# Altium schematic sheet bqZUM_MCU.SchDoc: MCU
size A4; Date: 20140214; Author: bq; CompanyName: bq - Mundo Reader; Organization: bq - Mundo Reader; DocumentNumber: 2; Revision: 3; SheetNumber: 2; SheetTotal: 8; ProjectName: bqduino
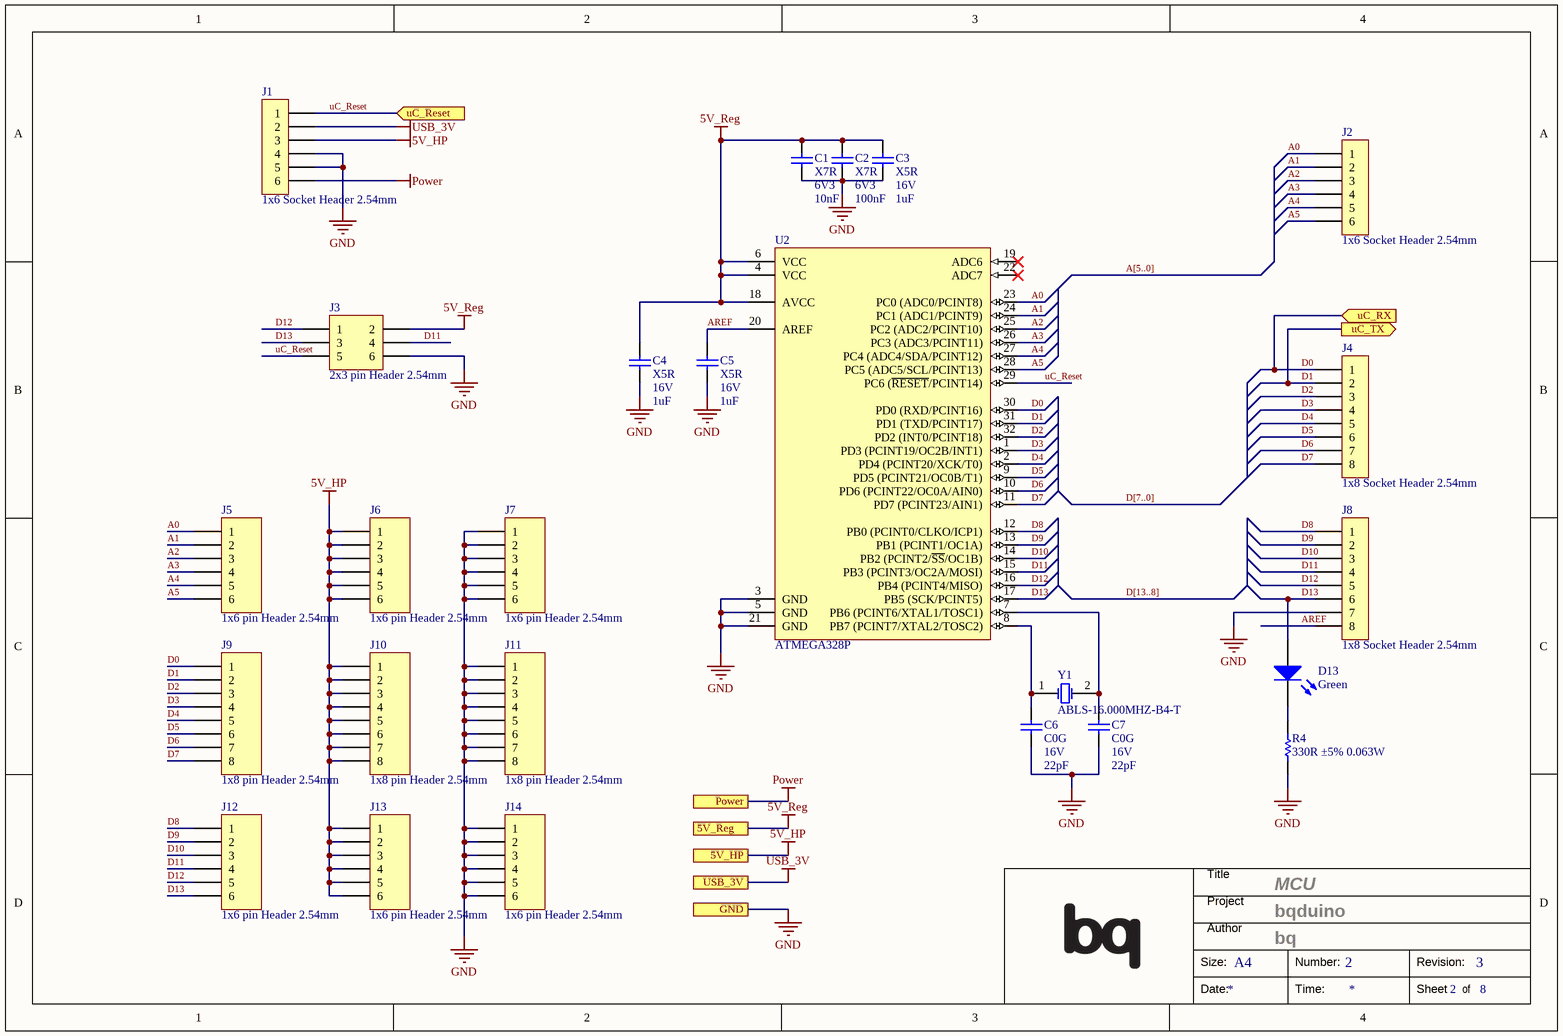
[diagram p0: bqZUM_MCU.SchDoc]

## Parts
C1  Dielectric: X7R  Voltage: 6V3  Capacitance: 10nF  [C0402]  (hidden comment: Capacitor)
C2  Dielectric: X7R  Voltage: 6V3  Capacitance: 100nF  [C0402]  (hidden comment: Capacitor)
C3  Dielectric: X5R  Voltage: 16V  Capacitance: 1uF  [C0603]  (hidden comment: Capacitor)
C4  Dielectric: X5R  Voltage: 16V  Capacitance: 1uF  [C0603]  (hidden comment: Capacitor)
C5  Dielectric: X5R  Voltage: 16V  Capacitance: 1uF  [C0603]  (hidden comment: Capacitor)
C6  Dielectric: C0G  Voltage: 16V  Capacitance: 22pF  [C0402]  (hidden comment: Capacitor)
C7  Dielectric: C0G  Voltage: 16V  Capacitance: 22pF  [C0402]  (hidden comment: Capacitor)
D13  Green  [LED0603]
J1  1x6 Socket Header 2.54mm  [1x6 Socket Header THT 2.54mm]
J2  1x6 Socket Header 2.54mm  [1x6 Socket Header THT 2.54mm]
J3  2x3 pin Header 2.54mm  [2x3 Pin Header 2.54]
J4  1x8 Socket Header 2.54mm  [1x8 Socket Header THT 2.54mm]
J5  1x6 pin Header 2.54mm  [1x6 Pin Header 2.54]
J6  1x6 pin Header 2.54mm  [1x6 Pin Header 2.54]
J7  1x6 pin Header 2.54mm  [1x6 Pin Header 2.54]
J8  1x8 Socket Header 2.54mm  [1x8 Socket Header THT 2.54mm]
J9  1x8 pin Header 2.54mm  [1x8 Pin Header 2.54]
J10  1x8 pin Header 2.54mm  [1x8 Pin Header 2.54]
J11  1x8 pin Header 2.54mm  [1x8 Pin Header 2.54]
J12  1x6 pin Header 2.54mm  [1x6 Pin Header 2.54]
J13  1x6 pin Header 2.54mm  [1x6 Pin Header 2.54]
J14  1x6 pin Header 2.54mm  [1x6 Pin Header 2.54]
R4  value 330R ±5% 0.063W  [R0402]  (hidden comment: Resistor)
U2  ATMEGA328P  [TQFP32]
Y1  ABLS-16.000MHZ-B4-T  [XTAL 11.4x4.7]

## Ports
5V_HP, 5V_Reg, GND, Power, uC_Reset (in), uC_RX (in), uC_TX (out), USB_3V

## Nets
5V_HP: J1.3 J6.1 J6.2 J6.3 J6.4 J6.5 J6.6 J10.1 J10.2 J10.3 J10.4 J10.5 J10.6 J10.7 J10.8 J13.1 J13.2 J13.3 J13.4 J13.5 J13.6 ; port 5V_HP
5V_Reg: C1.2 C2.2 C3.2 C4.2 J3.2 U2.4(VCC) U2.6(VCC) U2.18(AVCC) ; port 5V_Reg
GND: C1.1 C2.1 C3.1 C4.1 C5.1 C6.1 C7.1 J1.4 J1.5 J3.6 J7.1 J7.2 J7.3 J7.4 J7.5 J7.6 J8.7 J11.1 J11.2 J11.3 J11.4 J11.5 J11.6 J11.7 J11.8 J14.1 J14.2 J14.3 J14.4 J14.5 J14.6 R4.1 U2.3(GND) U2.5(GND) U2.21(GND) ; port GND
Power: J1.6 ; port Power
USB_3V: J1.2 ; port USB_3V
A0: J2.1 J5.1 U2.23(PC0_(ADC0/PCINT8))
A1: J2.2 J5.2 U2.24(PC1_(ADC1/PCINT9))
A2: J2.3 J5.3 U2.25(PC2_(ADC2/PCINT10))
A3: J2.4 J5.4 U2.26(PC3_(ADC3/PCINT11))
A4: J2.5 J5.5 U2.27(PC4_(ADC4/SDA/PCINT12))
A5: J2.6 J5.6 U2.28(PC5_(ADC5/SCL/PCINT13))
AREF: C5.2 J8.8 U2.20(AREF)
D0: J4.1 J9.1 U2.30(PD0_(RXD/PCINT16)) ; port uC_RX
D1: J4.2 J9.2 U2.31(PD1_(TXD/PCINT17)) ; port uC_TX
D2: J4.3 J9.3 U2.32(PD2_(INT0/PCINT18))
D3: J4.4 J9.4 U2.1(PD3_(PCINT19/OC2B/INT1))
D4: J4.5 J9.5 U2.2(PD4_(PCINT20/XCK/T0))
D5: J4.6 J9.6 U2.9(PD5_(PCINT21/OC0B/T1))
D6: J4.7 J9.7 U2.10(PD6_(PCINT22/OC0A/AIN0))
D7: J4.8 J9.8 U2.11(PD7_(PCINT23/AIN1))
D8: J8.1 J12.1 U2.12(PB0_(PCINT0/CLKO/ICP1))
D9: J8.2 J12.2 U2.13(PB1_(PCINT1/OC1A))
D10: J8.3 J12.3 U2.14(PB2_(PCINT2/~{SS}/OC1B))
D11: J3.4 J8.4 J12.4 U2.15(PB3_(PCINT3/OC2A/MOSI))
D12: J3.1 J8.5 J12.5 U2.16(PB4_(PCINT4/MISO))
D13: D13.A J3.3 J8.6 J12.6 U2.17(PB5_(SCK/PCINT5))
uC_Reset: J1.1 J3.5 U2.29(PC6_(~{RESET}/PCINT14)) ; port uC_Reset
NetC6_2: C6.2 U2.8(PB7_(PCINT7/XTAL2/TOSC2)) Y1.1(OSC1)
NetC7_2: C7.2 U2.7(PB6_(PCINT6/XTAL1/TOSC1)) Y1.2(OSC2)
NetD13_K: D13.K R4.2

Not connected (* = marked no-connect by the designer): U2 19(ADC6)* 22(ADC7)*

## Buses and harness runs
bus A[5..0]
bus D[7..0]
bus D[13..8]

## Notes on the sheet
- Title
- Project
- Size:
- Author
- A4
- Number:
- Revision:
- Date:
- Time:
- Sheet
- of

## Library data of the parts
C1 = C0402_10nF_6V3_±10%: Manufacturer: Kemet; Value: 10nF ±10% 6V3; Tolerance: ±10%; OrderingCode: C0402C103K9RAC; Temp_ Max: 125; Temp_ Min: -55; Part Number: C0402_10nF_6V3_±10%
C2 = C0402_100nF_6V3_±10%: Manufacturer: Kemet; Value: 100nF ±10% 6V3; Tolerance: ±10%; OrderingCode: C0402C104K9RAC; Temp_ Max: 125; Temp_ Min: -55; Part Number: C0402_100nF_6V3_±10%
C3-C5 = C0603_1uF_16V_±10%: Manufacturer: Kemet; Value: 1uF ±10% 16V; Tolerance: ±10%; OrderingCode: C0603C105K4PAC; Temp_ Max: 125; Temp_ Min: -55; Part Number: C0603_1uF_16V_±10%
C6 C7 = C0402_22pF_16V_±10%: Manufacturer: Kemet; Value: 22pF ±10% 16V; Tolerance: ±10%; OrderingCode: C0402C220K4GAC; Temp_ Max: 125; Temp_ Min: -55; Part Number: C0402_22pF_16V_±10%
D13 = HSMG-C190: Light Emitting Diode; Manufacturer: Avago Technologies; Temp_ Max: 85; Temp_ Min: -40; Part Number: HSMG-C190; OrderingCode: HSMG-C190; Value: Green
J1 = CON_SH_THT2.54_6: 6 pin Socket Header 2.54mm; Manufacturer: Samtec; OrderingCode: SSW-106-01-T-S; Temp_ Max: 125; Temp_ Min: -40; Value: 6; Pitch: 2.54mm; Part Number: CON_SH_THT2.54_6
J2 = CON_SH_THT2.54_6: 6 pin Socket Header 2.54mm; Manufacturer: Samtec; OrderingCode: SSW-106-01-T-S; Temp_ Max: 125; Temp_ Min: -40; Value: 6; OrderingCode 2: 613 006 118 21; Pitch: 2.54mm; Part Number: CON_SH_THT2.54_6; Supplier: Würth; Manufacturer 2: Würth Elektronik
J3 = CON_DPH_THT2.54_6: 6 pin Dual Header 2.54mm; Manufacturer: Samtec; OrderingCode: TSW-103-07-T-D; Temp_ Max: 125; Temp_ Min: -40; Value: 6; Pitch: 2.54mm; Part Number: CON_DPH_THT2.54_6
J4 J8 = CON_SH_THT2.54_8: 8 pin Socket Header 2.54mm; Manufacturer: Samtec; OrderingCode: SSW-108-01-T-S; Temp_ Max: 125; Temp_ Min: -40; Value: 8; Pitch: 2.54mm; Part Number: CON_SH_THT2.54_8
J5 = CON_PH_THT2.54_6 Blue: Manufacturer: Samtec; OrderingCode: TSW-106-07-T-S-BLUE; Temp_ Max: 125; Temp_ Min: -40; Pitch: 2.54mm; Part Number: CON_PH_THT2.54_6 Blue
J6 J13 = CON_PH_THT2.54_6 Red: Manufacturer: Samtec; OrderingCode: TSW-106-07-T-S-RED; Temp_ Max: 125; Temp_ Min: -40; Pitch: 2.54mm; Part Number: CON_PH_THT2.54_6 Red
J7 J14 = CON_PH_THT2.54_6: Manufacturer: Samtec; OrderingCode: TSW-106-07-T-S; Temp_ Max: 125; Temp_ Min: -40; Value: 6; OrderingCode 2: 613 006 111 21; Pitch: 2.54mm; Part Number: CON_PH_THT2.54_6; Manufacturer 2: Würth Elektronik
J9 = CON_PH_THT2.54_8 Natural: Manufacturer: Samtec; OrderingCode: TSW-108-07-T-S-NATURAL; Temp_ Max: 125; Temp_ Min: -40; Pitch: 2.54mm; Part Number: CON_PH_THT2.54_8 Natural
J10 = CON_PH_THT2.54_8 Red: Manufacturer: Samtec; OrderingCode: TSW-108-07-T-S-RED; Temp_ Max: 125; Temp_ Min: -40; Pitch: 2.54mm; Part Number: CON_PH_THT2.54_8 Red
J11 = CON_PH_THT2.54_8: Manufacturer: Samtec; OrderingCode: TSW-108-07-T-S; Temp_ Max: 125; Temp_ Min: -40; Value: 8; OrderingCode 2: 613 008 111 21; Pitch: 2.54mm; Part Number: CON_PH_THT2.54_8; Manufacturer 2: Würth Elektronik
J12 = CON_PH_THT2.54_6 Natural: Manufacturer: Samtec; OrderingCode: TSW-106-07-T-S-NATURAL; Temp_ Max: 125; Temp_ Min: -40; Pitch: 2.54mm; Part Number: CON_PH_THT2.54_6 Natural
R4 = R0402_330R_0.063W_±5%: Manufacturer: Vishay; Tolerance: ±5%; OrderingCode: CRCW0402330RJN; Power: 0.063W; Resistance: 330R; Temp_ Max: 155; Temp_ Min: -55; PackageDescription: SMD; Part Number: R0402_330R_0.063W_±5%
U2 = ATMEGA328P: 8-bit AVR Microcontroller; Manufacturer: Atmel; OrderingCode: ATMEGA328P-AU; Temp_ Max: 85; Temp_ Min: -40; Part Number: ATMEGA328P; Supplier: EBV
Y1 = ABLS 16MHz: Crystal; Manufacturer: Abracon; Tolerance: ±30ppm; Load Capacitance: 18pF; Temp_ Max: 70; Temp_ Min: -20; Value: 16MHz; Part Number: ABLS 16MHz; OrderingCode: ABLS-16.000MHZ-B4-T